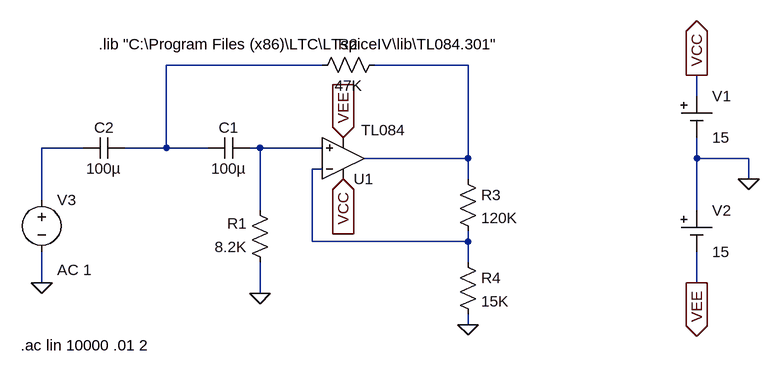
[diagram p0: schematic HPF.asc]
HPF.asc, the LTspice schematic file:
Version 4
SHEET 1 980 680
WIRE 304 -48 64 -48
WIRE 528 -48 384 -48
WIRE 880 0 880 -32
WIRE -64 80 -128 80
WIRE 64 80 64 -48
WIRE 64 80 0 80
WIRE 128 80 64 80
WIRE 208 80 192 80
WIRE 304 80 208 80
WIRE 528 96 528 -48
WIRE 528 96 368 96
WIRE 880 96 880 64
WIRE 960 96 880 96
WIRE 304 112 288 112
WIRE 528 128 528 96
WIRE 960 128 960 96
WIRE -128 160 -128 80
WIRE 208 176 208 80
WIRE 880 176 880 96
WIRE 288 224 288 112
WIRE 528 224 528 208
WIRE 528 224 288 224
WIRE 528 256 528 224
WIRE -128 288 -128 240
WIRE 880 288 880 240
WIRE 208 304 208 256
WIRE 528 352 528 336
FLAG 208 304 0
FLAG 528 352 0
FLAG 336 64 VEE
IOPIN 336 64 In
FLAG 336 128 VCC
IOPIN 336 128 In
FLAG 960 128 0
FLAG 880 288 VEE
IOPIN 880 288 Out
FLAG 880 -32 VCC
IOPIN 880 -32 Out
FLAG -128 288 0
SYMBOL Opamps\\opamp2 336 160 M180
WINDOW 3 28 108 Left 2
SYMATTR Value TL084
SYMATTR InstName U1
SYMBOL res 224 272 R180
WINDOW 0 36 76 Left 2
WINDOW 3 36 40 Left 2
SYMATTR InstName R1
SYMATTR Value 8.2K
SYMBOL res 400 -64 R90
WINDOW 0 0 56 VBottom 2
WINDOW 3 32 56 VTop 2
SYMATTR InstName R2
SYMATTR Value 47K
SYMBOL cap 192 64 R90
WINDOW 0 0 32 VBottom 2
WINDOW 3 32 32 VTop 2
SYMATTR InstName C1
SYMATTR Value 100µ
SYMBOL cap -64 96 R270
WINDOW 0 32 32 VTop 2
WINDOW 3 0 32 VBottom 2
SYMATTR InstName C2
SYMATTR Value 100µ
SYMBOL res 512 112 R0
SYMATTR InstName R3
SYMATTR Value 120K
SYMBOL res 512 240 R0
SYMATTR InstName R4
SYMATTR Value 15K
SYMBOL Misc\\cell 880 0 R0
WINDOW 123 0 0 Left 2
WINDOW 39 0 0 Left 2
SYMATTR InstName V1
SYMATTR Value 15
SYMBOL Misc\\cell 880 176 R0
WINDOW 123 0 0 Left 2
WINDOW 39 0 0 Left 2
SYMATTR InstName V2
SYMATTR Value 15
SYMBOL voltage -128 144 R0
WINDOW 123 24 124 Left 2
WINDOW 39 0 0 Left 2
SYMATTR Value2 AC 1
SYMATTR InstName V3
SYMATTR Value ""
TEXT -160 384 Left 2 !.ac lin 10000 .01 2
TEXT -40 -80 Left 2 !.lib "C:\\Program Files (x86)\\LTC\\LTspiceIV\\lib\\TL084.301"

The netlist it stands for:
* HPF.asc
XU1 N004 N005 VCC VEE N002 TL084  ; pins In+ In- V+ V- OUT
R1 0 N004 8.2K
R2 N002 N001 47K
C1 N004 N001 100µ
C2 N003 N001 100µ
R3 N002 N005 120K
R4 N005 0 15K
V1 VCC 0 15
V2 0 VEE 15
V3 N003 0 AC 1
.ac lin 10000 .01 2
.lib "C:\Program Files (x86)\LTC\LTspiceIV\lib\TL084.301"
.backanno
.end